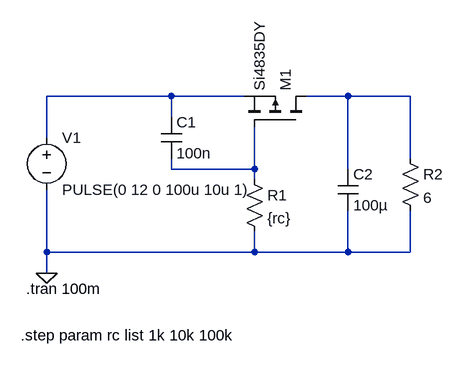
[diagram p0: schematic main.asc]
main.asc, the LTspice schematic file:
Version 4
SHEET 1 880 680
WIRE 176 80 -16 80
WIRE 288 80 176 80
WIRE 448 80 384 80
WIRE 544 80 448 80
WIRE 176 112 176 80
WIRE -16 144 -16 80
WIRE 544 176 544 80
WIRE 176 192 176 176
WIRE 304 192 304 128
WIRE 304 192 176 192
WIRE 448 192 448 80
WIRE 304 208 304 192
WIRE -16 320 -16 224
WIRE 304 320 304 288
WIRE 304 320 -16 320
WIRE 448 320 448 256
WIRE 448 320 304 320
WIRE 544 320 544 256
WIRE 544 320 448 320
WIRE -16 352 -16 320
FLAG -16 352 0
SYMBOL voltage -16 128 R0
WINDOW 123 0 0 Left 0
WINDOW 39 0 0 Left 0
SYMATTR InstName V1
SYMATTR Value PULSE(0 12 0 100u 10u 1)
SYMBOL cap 160 112 R0
SYMATTR InstName C1
SYMATTR Value 100n
SYMBOL res 288 192 R0
SYMATTR InstName R1
SYMATTR Value {rc}
SYMBOL pmos 384 128 M270
SYMATTR InstName M1
SYMATTR Value Si4835DY
SYMBOL res 528 160 R0
SYMATTR InstName R2
SYMATTR Value 6
SYMBOL cap 432 192 R0
SYMATTR InstName C2
SYMATTR Value 100µ
TEXT -48 376 Left 2 !.tran 100m
TEXT -56 448 Left 2 !.step param rc list 1k 10k 100k

The netlist it stands for:
* main.asc
V1 N001 0 PULSE(0 12 0 100u 10u 1)
C1 N001 N003 100n
R1 N003 0 {rc}
M1 N002 N003 N001 N001 Si4835DY
R2 N002 0 6
C2 N002 0 100µ
.model NMOS NMOS
.model PMOS PMOS
.lib standard.mos
.tran 100m
.step param rc list 1k 10k 100k
.backanno
.end